# Altium schematic sheet USBC_B.SchDoc: DARKYDEN_USBC_B
size Letter; ApprovedBy: APPROUVÉ PAR; Author: Harold Malbrouck; Organization: Cegep Limoilou; Address1: 1300, 8e Avenue; Address2: Québec, QC; Address3: Canada; Address4: G1J 5L5; Revision: Rev.E; SheetNumber: 2; SheetTotal: 22
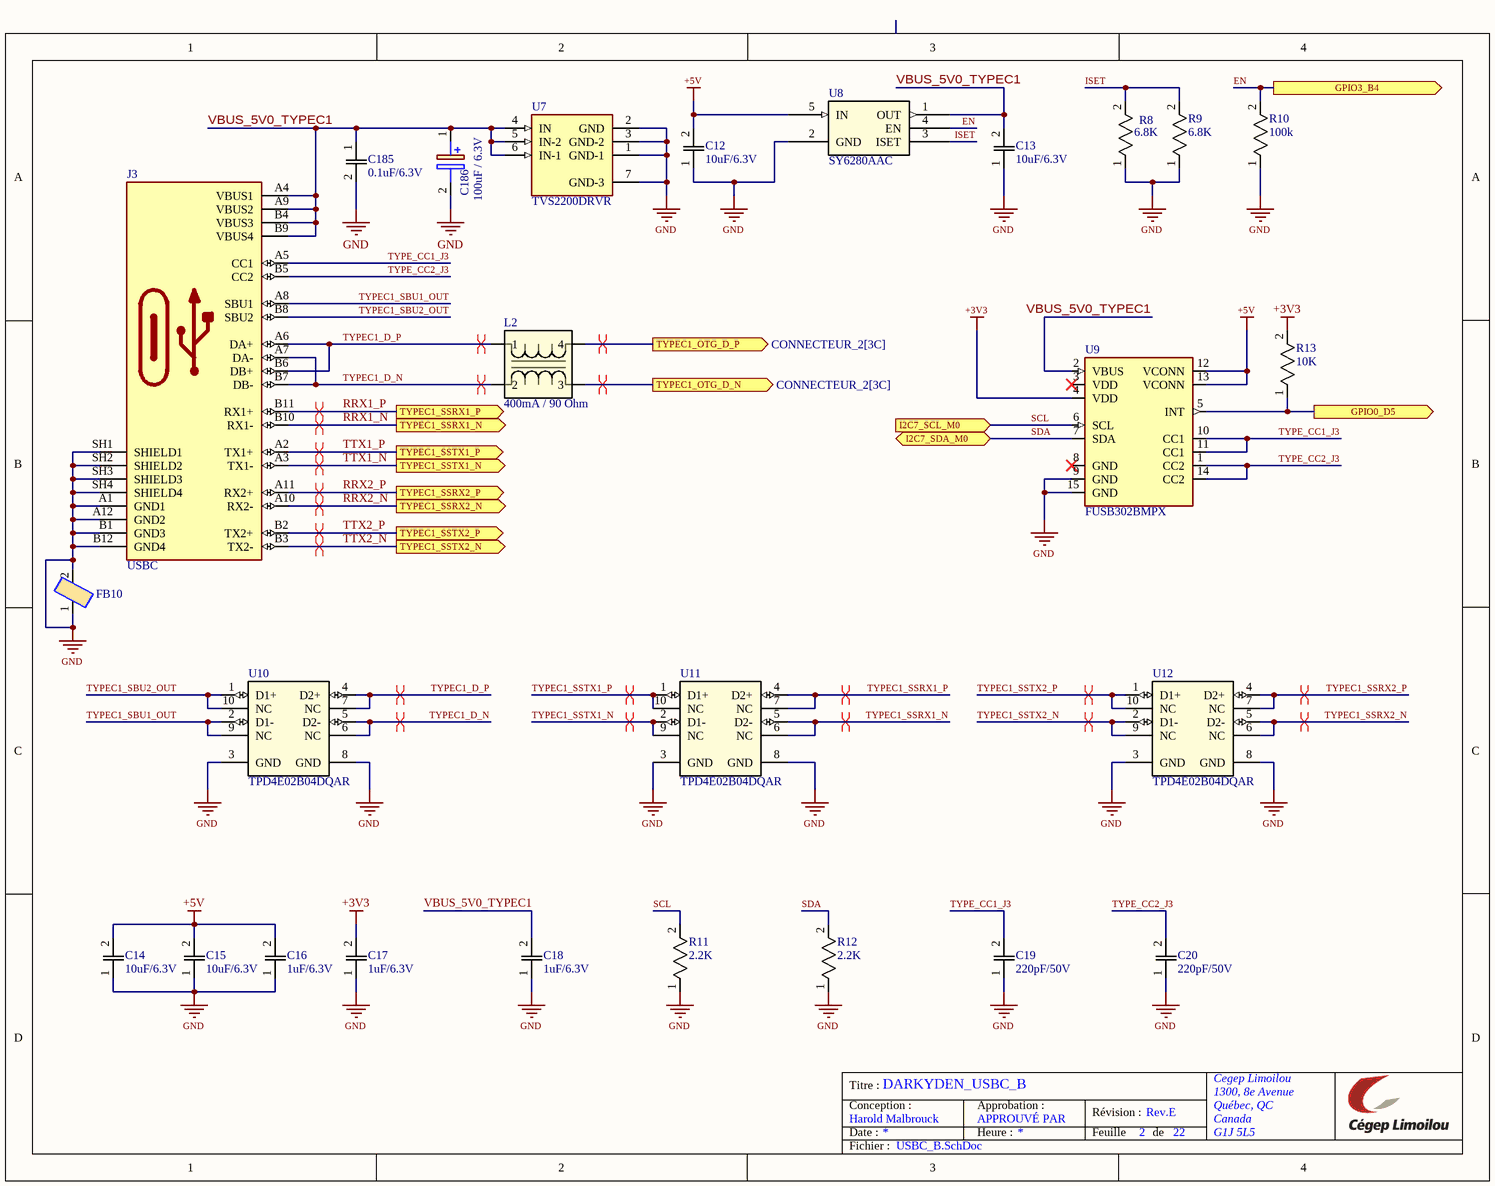
[diagram p0: USBC_B.SchDoc]

## Parts
C12  10uF/6.3V  [C0805]
C13  10uF/6.3V  [C0805]
C14  10uF/6.3V  [C0805]
C15  10uF/6.3V  [C0805]
C16  1uF/6.3V  [C0805]
C17  1uF/6.3V  [C0805]
C18  1uF/6.3V  [C0805]
C19  220pF/50V  [CAPC220145_88N_KEM]
C20  220pF/50V  [CAPC220145_88N_KEM]
C185  0.1uF/6.3V  [C0805]
C186  100uF / 6.3V  [EEE0GA101SR]
FB10  220R / 100MHz  [BLM18SP221SN1B]  (value not drawn)
J3  USBC  [MOLEX_2012670005]
L2  400mA / 90 Ohm  [ACM20129002PT002]
R8  6.8K  [ERJ3EKF1000V]
R9  6.8K  [ERJ3EKF1000V]
R10  100k  [ERJ3EKF1000V]
R11  2.2K  [ERJ3EKF1000V]
R12  2.2K  [ERJ3EKF1000V]
R13  10K  [ERJ3EKF1000V]
U7  TVS2200DRVR  [SON65P200X200X80-7N]
U8  SY6280AAC  [SOT95P285X140-5N]
U9  FUSB302BMPX  [QFN50P250X250X80-15N]
U10  TPD4E02B04DQAR  [DQA0010A]
U11  TPD4E02B04DQAR  [DQA0010A]
U12  TPD4E02B04DQAR  [DQA0010A]

## Ports
GPIO0_D5 (out, see CONNECTEUR_3[3C]), GPIO3_B4 (out, see CONNECTEUR_4[3C]), I2C7_SCL_M0 (in, see CONNECTEUR_2[1A]), I2C7_SDA_M0 (bidir, see CONNECTEUR_2[1A]), TYPEC1_OTG_D_N (out, see CONNECTEUR_2[3C]), TYPEC1_OTG_D_P (out, see CONNECTEUR_2[3C]), TYPEC1_SSRX1_N (out, see CONNECTEUR_2[1C]), TYPEC1_SSRX1_P (out, see CONNECTEUR_2[1C]), TYPEC1_SSRX2_N (out, see CONNECTEUR_2[1C]), TYPEC1_SSRX2_P (out, see CONNECTEUR_2[1C]), TYPEC1_SSTX1_N (out, see CONNECTEUR_2[1C]), TYPEC1_SSTX1_P (out, see CONNECTEUR_2[1C]), TYPEC1_SSTX2_N (out, see CONNECTEUR_2[1C]), TYPEC1_SSTX2_P (out, see CONNECTEUR_2[1C])

## Nets
+3V3: C17.2 R13.2 U9.4(VDD)
+5V: C12.2 C14.2 C15.2 C16.2 U8.5(IN) U9.12(VCONN) U9.13(VCONN)
GND: C12.1 C13.1 C14.1 C15.1 C16.1 C17.1 C18.1 C19.1 C20.1 C185.2 C186.2(-) FB10.1 FB10.2 J3.A1(GND1) J3.A12(GND2) J3.B1(GND3) J3.B12(GND4) J3.SH1(SHIELD1) J3.SH2(SHIELD2) J3.SH3(SHIELD3) J3.SH4(SHIELD4) R8.1 R9.1 R10.1 R11.1 R12.1 U7.1(GND-1) U7.2(GND) U7.3(GND-2) U7.7(GND-3) U8.2(GND) U9.9(GND) U9.15(GND) U10.3(GND) U10.8(GND) U11.3(GND) U11.8(GND) U12.3(GND) U12.8(GND)
EN: R10.2 U8.4(EN) ; port GPIO3_B4
GPIO0_D5: R13.1 U9.5(INT) ; port GPIO0_D5
ISET: R8.2 R9.2 U8.3(ISET)
RRX1_N: J3.B10(RX1-) ; port TYPEC1_SSRX1_N
RRX1_P: J3.B11(RX1+) ; port TYPEC1_SSRX1_P
RRX2_N: J3.A10(RX2-) ; port TYPEC1_SSRX2_N
RRX2_P: J3.A11(RX2+) ; port TYPEC1_SSRX2_P
SCL: R11.2 U9.6(SCL) ; port I2C7_SCL_M0
SDA: R12.2 U9.7(SDA) ; port I2C7_SDA_M0
TTX1_N: J3.A3(TX1-) ; port TYPEC1_SSTX1_N
TTX1_P: J3.A2(TX1+) ; port TYPEC1_SSTX1_P
TTX2_N: J3.B3(TX2-) ; port TYPEC1_SSTX2_N
TTX2_P: J3.B2(TX2+) ; port TYPEC1_SSTX2_P
TYPE_CC1_J3: C19.2 J3.A5(CC1) U9.10(CC1) U9.11(CC1)
TYPE_CC2_J3: C20.2 J3.B5(CC2) U9.1(CC2) U9.14(CC2)
TYPEC1_D_N: J3.A7(DA-) J3.B7(DB-) L2.2 U10.5(D2-) U10.6(NC)
TYPEC1_D_P: J3.A6(DA+) J3.B6(DB+) L2.1 U10.4(D2+) U10.7(NC)
TYPEC1_OTG_D_N: L2.3 ; port TYPEC1_OTG_D_N
TYPEC1_OTG_D_P: L2.4 ; port TYPEC1_OTG_D_P
TYPEC1_SBU1_OUT: J3.A8(SBU1) U10.2(D1-) U10.9(NC)
TYPEC1_SBU2_OUT: J3.B8(SBU2) U10.1(D1+) U10.10(NC)
TYPEC1_SSRX1_N: U11.5(D2-) U11.6(NC)
TYPEC1_SSRX1_P: U11.4(D2+) U11.7(NC)
TYPEC1_SSRX2_N: U12.5(D2-) U12.6(NC)
TYPEC1_SSRX2_P: U12.4(D2+) U12.7(NC)
TYPEC1_SSTX1_N: U11.2(D1-) U11.9(NC)
TYPEC1_SSTX1_P: U11.1(D1+) U11.10(NC)
TYPEC1_SSTX2_N: U12.2(D1-) U12.9(NC)
TYPEC1_SSTX2_P: U12.1(D1+) U12.10(NC)
VBUS_5V0_TYPEC1: C13.2 C18.2 C185.1 C186.1(+) J3.A4(VBUS1) J3.A9(VBUS2) J3.B4(VBUS3) J3.B9(VBUS4) U7.4(IN) U7.5(IN-2) U7.6(IN-1) U8.1(OUT) U9.2(VBUS)

Not connected (* = marked no-connect by the designer): U9 3(VDD)* 8(GND)*

## Layout directives
differential pair: RRX1_N, RRX1_P, RRX2_N, RRX2_P, TTX1_N, TTX1_P, TTX2_N, TTX2_P, TYPEC1_D_N, TYPEC1_D_P, TYPEC1_OTG_D_N, TYPEC1_OTG_D_P, TYPEC1_SSRX1_N, TYPEC1_SSRX1_P, TYPEC1_SSRX2_N, TYPEC1_SSRX2_P, TYPEC1_SSTX1_N, TYPEC1_SSTX1_P, TYPEC1_SSTX2_N, TYPEC1_SSTX2_P

## Notes on the sheet
- Titre :
- Conception :
- Date :
- Approbation :
- Heure :
- Révision :
- Feuille
- de
- Fichier :

## Library data of the parts
C12-C15 = C0805C106K9RACTU: 10uF/6.3V SMD Comm X7R 0805 (2012Metric) Ceramic Capacitor 0.079Lx0.049W 2.00mmx1.25mm X7R ±10% 10muF; Manufacturer_Name: KEMET; Material: 4241ConductorMaterial; Value: 10uF; Voltage Rating: 6.3V; Dissipation Factor: 7.5%; Datasheet Link: https://content.kemet.com/datasheets/KEM_C1002_X7R_SMD.pdf; Height: 1.1mm; Manufacturer_Part_Number: C0805C106K9RACTU; Mouser Part Number: 80-C0805C106K9R; Mouser Price/Stock: https://www.mouser.co.uk/ProductDetail/KEMET/C0805C106K9RACTU?qs=iP0bYSAMAFo3iKcrfaqAag%3D%3D; Arrow Part Number: C0805C106K9RACTU; Arrow Price/Stock: https://www.arrow.com/en/products/c0805c106k9ractu/kemet-corporation?region=nac; Supplier: Digikey; Supplier Part Number: 399-C0805C106K9RACTUCT-ND; Manufacturer: KEMET; Manufacturer Part Number: C0805C106K9RACTU; RoHS: Yes; Category: Ceramic Capacitors; Stock: 12575; Pricing: 1=0.34, 10=0.203, 100=0.1327, 1000=0.0974 (USD); Mounting Technology: Surface Mount; Case/Package: 0805; Case Code (Metric): 2012; Case Code (Imperial): 0805; Dielectric Material: Ceramic; Min Operating Temperature: -55°C; Max Operating Temperature: 125°C; Package Quantity: 1; Tolerance: 10%; Packaging: Tape and Reel; Voltage Rating (DC): 6.3V; Dielectric: X7R; Termination: SMD/SMT; Series: C; Length: 2mm; Width: 0.049inch; Thickness: 0.055inch; Depth: 1.25mm; Reach SVHC Compliant: No; RoHS Compliant: Yes; ComponentLink1URL: http://www.farnell.com/datasheets/2745931.pdf?src-supplier=Farnell; ComponentLink1Description: http://www.farnell.com/datasheets/2745931.pdf?src-supplier=Farnell; ComponentLink2URL: http://www.mouser.com/ds/2/212/KEM_C1002_X7R_SMD-1102033.pdf?src-supplier=Mouser; ComponentLink2Description: http://www.mouser.com/ds/2/212/KEM_C1002_X7R_SMD-1102033.pdf?src-supplier=Mouser; ComponentLink3URL: http://datasheet.octopart.com/C0805C106K9RACTU-KEMET-datasheet-157246124.pdf?src-supplier=Avnet; ComponentLink3Description: http://datasheet.octopart.com/C0805C106K9RACTU-KEMET-datasheet-157246124.pdf?src-supplier=Avnet; ComponentLink4URL: http://datasheet.octopart.com/C0805C106K9RACTU-KEMET-datasheet-157246124.pdf?src-supplier=Verical; ComponentLink4Description: http://datasheet.octopart.com/C0805C106K9RACTU-KEMET-datasheet-157246124.pdf?src-supplier=Verical; ComponentLink5URL: http://datasheet.octopart.com/C0805C106K9RACTU-KEMET-datasheet-157246124.pdf?src-supplier=Onlinecomponents.com; ComponentLink5Description: http://datasheet.octopart.com/C0805C106K9RACTU-KEMET-datasheet-157246124.pdf?src-supplier=Onlinecomponents.com; ComponentLink6URL: http://components.arrow.com/part/dataview/53801129S170069N7429?src-supplier=Arrow+Electronics; ComponentLink6Description: http://components.arrow.com/part/dataview/53801129S170069N7429?src-supplier=Arrow+Electronics; ComponentLink7URL: http://www.farnell.com/datasheets/1828800.pdf?src-supplier=Newark; ComponentLink7Description: http://www.farnell.com/datasheets/1828800.pdf?src-supplier=Newark; ComponentLink8URL: http://datasheet.octopart.com/C0805C106K9RACTU-KEMET-datasheet-157246124.pdf?src-supplier=Digikey; ComponentLink8Description: http://datasheet.octopart.com/C0805C106K9RACTU-KEMET-datasheet-157246124.pdf?src-supplier=Digikey; ComponentLink9URL: https://api.kemet.com/component-edge/download/datasheet/C0805C106K9RACTU.pdf?src-supplier=Digikey; ComponentLink9Description: https://api.kemet.com/component-edge/download/datasheet/C0805C106K9RACTU.pdf?src-supplier=Digikey; ComponentLink10URL: http://www.farnell.com/datasheets/2745931.pdf?src-supplier=Element14; ComponentLink10Description: http://www.farnell.com/datasheets/2745931.pdf?src-supplier=Element14; ComponentLink11URL: https://datasheet.octopart.com/C0805C106K9RACTU-Kemet-datasheet-66076756.pdf?src-supplier=Element14; ComponentLink11Description: https://datasheet.octopart.com/C0805C106K9RACTU-Kemet-datasheet-66076756.pdf?src-supplier=Element14; ComponentLink12URL: http://datasheet.octopart.com/C0805C106K9RACTU-KEMET-datasheet-157246124.pdf?src-supplier=Rs; ComponentLink12Description: http://datasheet.octopart.com/C0805C106K9RACTU-KEMET-datasheet-157246124.pdf?src-supplier=Rs; ComponentLink13URL: http://www.farnell.com/datasheets/1791936.pdf?src-supplier=Newark; ComponentLink13Description: http://www.farnell.com/datasheets/1791936.pdf?src-supplier=Newark; ComponentLink14URL: http://datasheet.octopart.com/C0805C106K9RACTU-KEMET-datasheet-157246124.pdf?src-supplier=Electro+Sonic; ComponentLink14Description: http://datasheet.octopart.com/C0805C106K9RACTU-KEMET-datasheet-157246124.pdf?src-supplier=Electro+Sonic; ComponentLink15URL: https://datasheet.octopart.com/C0805C106K9RACTU-KEMET-datasheet-157246124.pdf?src-supplier=TME; ComponentLink15Description: https://datasheet.octopart.com/C0805C106K9RACTU-KEMET-datasheet-157246124.pdf?src-supplier=TME; ComponentLink16URL: http://datasheet.octopart.com/C0805C106K9RACTU-KEMET-datasheet-157246124.pdf?src-supplier=NAC+Semi; ComponentLink16Description: http://datasheet.octopart.com/C0805C106K9RACTU-KEMET-datasheet-157246124.pdf?src-supplier=NAC+Semi
C16-C18 = C0805C105K9RACTU: 1 uF, 6.3 V, ± 10%, X7R, 0805 [2012 Metric] Multilayer Ceramic Capacitor,; Manufacturer_Name: KEMET; Value: 1uF; Voltage Rating: 6.3V; Datasheet Link: https://content.kemet.com/datasheets/KEM_C1002_X7R_SMD.pdf; Height: 1.1mm; Manufacturer_Part_Number: C0805C105K9RACTU; Mouser Part Number: 80-C0805C105K9R; Mouser Price/Stock: https://www.mouser.co.uk/ProductDetail/KEMET/C0805C105K9RACTU?qs=Nnkldhwoc36daYb4WU%2Fecw%3D%3D; Arrow Part Number: C0805C105K9RACTU; Arrow Price/Stock: https://www.arrow.com/en/products/c0805c105k9ractu/kemet-corporation?utm_currency=USD&region=nac; Supplier: Digikey; Supplier Part Number: 399-13161-1-ND; Manufacturer: KEMET; Manufacturer Part Number: C0805C105K9RACTU; RoHS: Yes; Category: Ceramic Capacitors; Stock: 8847; Pricing: 1=0.49, 10=0.397, 100=0.3017, 1000=0.24335, 2500=0.22102, 5000=0.20619, 7500=0.16784, 12500=0.12939, 17500=0.02492, 25000=0.02414, 62500=0.02244, 125000=0.02142, 250000=0.02059 (USD); Mounting Technology: Surface Mount; Case/Package: 0805; Case Code (Metric): 2012; Case Code (Imperial): 0805; Dielectric Material: Ceramic; Min Operating Temperature: -55°C; Max Operating Temperature: 125°C; Packaging: Tape and Reel; Tolerance: 10%; Package Quantity: 4000; Voltage Rating (DC): 6.3V; Dielectric: X7R; Termination: SMD/SMT; Series: C0805C; Construction: Flat; Length: 2mm; Width: 1.2mm; Thickness: 0.039inch; Lead Pitch: 0.75mm; Depth: 1.25mm; Radiation Hardening: No; RoHS Compliant: Yes; ComponentLink1URL: https://datasheet.ciiva.com/5416/kem-c1002-x7r-smd-5416463.pdf?src-supplier=Mouser; ComponentLink1Description: https://datasheet.ciiva.com/5416/kem-c1002-x7r-smd-5416463.pdf?src-supplier=Mouser
C19 C20 = C0805C221M5RACTU: Cap Ceramic 220pF 50V X7R 20% Pad SMD 0805 125C T/R; Mfr_Name: Kemet; Supplier: Digikey; Supplier Part Number: 399-C0805C221M5RACTUCT-ND; Manufacturer: KEMET; Manufacturer Part Number: C0805C221M5RACTU; RoHS: Yes; Category: Ceramic Capacitors; Stock: 68781; Pricing: 1=0.1, 10=0.086, 100=0.0162 (USD); Mounting Technology: Surface Mount; Case/Package: 0805; Case Code (Metric): 2012; Case Code (Imperial): 0805; Dielectric Material: Ceramic; Contact Plating: Tin,Matte; Min Operating Temperature: -55°C; Max Operating Temperature: 125°C; Package Quantity: 1; Value: 220pF; Voltage Rating: 50V; Tolerance: 20%; Packaging: Tape and Reel; Voltage Rating (DC): 50V; Dielectric: X7R; Termination: SMD/SMT; Series: C; Length: 2mm; Width: 0.049inch; Height: 0.78mm; Thickness: 0.035inch; Lead Pitch: 0.75mm; Depth: 1.25mm; ComponentLink1URL: http://www.farnell.com/datasheets/2746355.pdf?src-supplier=Farnell; ComponentLink1Description: http://www.farnell.com/datasheets/2746355.pdf?src-supplier=Farnell; ComponentLink2URL: http://www.mouser.com/ds/2/212/KEM_C1002_X7R_SMD-1102033.pdf?src-supplier=Mouser; ComponentLink2Description: http://www.mouser.com/ds/2/212/KEM_C1002_X7R_SMD-1102033.pdf?src-supplier=Mouser; ComponentLink3URL: http://components.arrow.com/part/dataview/2091709S5746747N7429?src-supplier=Arrow+Electronics; ComponentLink3Description: http://components.arrow.com/part/dataview/2091709S5746747N7429?src-supplier=Arrow+Electronics; ComponentLink4URL: https://api.kemet.com/component-edge/download/datasheet/C0805C221M5RACTU.pdf?src-supplier=Digikey; ComponentLink4Description: https://api.kemet.com/component-edge/download/datasheet/C0805C221M5RACTU.pdf?src-supplier=Digikey; ComponentLink5URL: https://datasheet.octopart.com/C0805C221M5RACTU-KEMET-datasheet-149524118.pdf?src-supplier=Farnell; ComponentLink5Description: https://datasheet.octopart.com/C0805C221M5RACTU-KEMET-datasheet-149524118.pdf?src-supplier=Farnell; ComponentLink6URL: http://capacitoredge.kemet.com/capedge2/DataSheet?pn=C0805C221M5RACTU&src-supplier=Avnet; ComponentLink6Description: http://capacitoredge.kemet.com/capedge2/DataSheet?pn=C0805C221M5RACTU&src-supplier=Avnet; ComponentLink7URL: https://datasheet.octopart.com/C0805C221M5RACTU-Kemet-datasheet-62307647.pdf?src-supplier=Element14; ComponentLink7Description: https://datasheet.octopart.com/C0805C221M5RACTU-Kemet-datasheet-62307647.pdf?src-supplier=Element14; ComponentLink8URL: http://www.farnell.com/datasheets/2746355.pdf?src-supplier=Newark; ComponentLink8Description: http://www.farnell.com/datasheets/2746355.pdf?src-supplier=Newark; ComponentLink9URL: https://datasheet.octopart.com/C0805C221M5RACTU-KEMET-datasheet-137045082.pdf?src-supplier=TME; ComponentLink9Description: https://datasheet.octopart.com/C0805C221M5RACTU-KEMET-datasheet-137045082.pdf?src-supplier=TME
C185 = C0805C104K9RACTU: 0.1uF 6.3V X7R 10% Pad SMD 0805 125C T/R; Manufacturer_Name: KEMET; Dielectric Material: Ceramic; Material: 4241ConductorMaterial; Value: 100nF; Datasheet Link: https://content.kemet.com/datasheets/KEM_C1002_X7R_SMD.pdf; Height: 1.1mm; Manufacturer_Part_Number: C0805C104K9RACTU; Mouser Part Number: 80-C0805C104K9R; Mouser Price/Stock: https://www.mouser.co.uk/ProductDetail/KEMET/C0805C104K9RACTU?qs=jbCUrP3sAgRYLjBU7s5h8Q%3D%3D; Arrow Part Number: C0805C104K9RACTU; Arrow Price/Stock: https://www.arrow.com/en/products/c0805c104k9ractu/kemet-corporation; Supplier: Digikey; Supplier Part Number: 399-C0805C104K9RACTUCT-ND; Manufacturer: KEMET; Manufacturer Part Number: C0805C104K9RACTU; RoHS: Yes; Category: Ceramic Capacitors; Stock: 68008; Pricing: 1=0.21, 10=0.214, 100=0.1506, 1000=0.11154 (USD); Mounting Technology: Surface Mount; Case/Package: 0805; Case Code (Metric): 2012; Case Code (Imperial): 0805; Min Operating Temperature: -55°C; Max Operating Temperature: 125°C; Package Quantity: 4000; Voltage Rating: 6.3V; Tolerance: 10%; Packaging: Tape and Reel; Voltage Rating (DC): 6.3V; Dielectric: X7R; Termination: SMD/SMT; Series: SMD Comm X7R; Construction: Flat; Length: 2mm; Width: 1.2mm; Thickness: 0.039inch; Depth: 1.25mm; Radiation Hardening: No; RoHS Compliant: Yes; ComponentLink1URL: http://www.farnell.com/datasheets/2746329.pdf?src-supplier=Farnell; ComponentLink1Description: http://www.farnell.com/datasheets/2746329.pdf?src-supplier=Farnell; ComponentLink2URL: http://www.mouser.com/ds/2/212/KEM_C1002_X7R_SMD-1102033.pdf?src-supplier=Mouser; ComponentLink2Description: http://www.mouser.com/ds/2/212/KEM_C1002_X7R_SMD-1102033.pdf?src-supplier=Mouser; ComponentLink3URL: http://datasheet.octopart.com/C0805C104K9RACTU-KEMET-datasheet-157246124.pdf?src-supplier=Avnet; ComponentLink3Description: http://datasheet.octopart.com/C0805C104K9RACTU-KEMET-datasheet-157246124.pdf?src-supplier=Avnet; ComponentLink4URL: http://datasheet.octopart.com/C0805C104K9RACTU-KEMET-datasheet-157246124.pdf?src-supplier=Onlinecomponents.com; ComponentLink4Description: http://datasheet.octopart.com/C0805C104K9RACTU-KEMET-datasheet-157246124.pdf?src-supplier=Onlinecomponents.com; ComponentLink5URL: http://capacitoredge.kemet.com/capedge2/DataSheet?pn=C0805C104K9RACTU&src-supplier=Avnet; ComponentLink5Description: http://capacitoredge.kemet.com/capedge2/DataSheet?pn=C0805C104K9RACTU&src-supplier=Avnet; ComponentLink6URL: http://www.farnell.com/datasheets/2746329.pdf?src-supplier=Newark; ComponentLink6Description: http://www.farnell.com/datasheets/2746329.pdf?src-supplier=Newark; ComponentLink7URL: http://datasheet.octopart.com/C0805C104K9RACTU-KEMET-datasheet-157246124.pdf?src-supplier=Digikey; ComponentLink7Description: http://datasheet.octopart.com/C0805C104K9RACTU-KEMET-datasheet-157246124.pdf?src-supplier=Digikey; ComponentLink8URL: https://api.kemet.com/component-edge/download/datasheet/C0805C104K9RACTU.pdf?src-supplier=Digikey; ComponentLink8Description: https://api.kemet.com/component-edge/download/datasheet/C0805C104K9RACTU.pdf?src-supplier=Digikey; ComponentLink9URL: https://datasheet.octopart.com/C0805C104K9RACTU.-KEMET-datasheet-179056791.pdf?src-supplier=Element14; ComponentLink9Description: https://datasheet.octopart.com/C0805C104K9RACTU.-KEMET-datasheet-179056791.pdf?src-supplier=Element14; ComponentLink10URL: https://datasheet.octopart.com/C0805C104K9RACTU-KEMET-datasheet-137357759.pdf?src-supplier=Farnell; ComponentLink10Description: https://datasheet.octopart.com/C0805C104K9RACTU-KEMET-datasheet-137357759.pdf?src-supplier=Farnell; ComponentLink11URL: http://www.farnell.com/datasheets/2746329.pdf?src-supplier=Element14; ComponentLink11Description: http://www.farnell.com/datasheets/2746329.pdf?src-supplier=Element14; ComponentLink12URL: https://datasheet.octopart.com/C0805C104K9RACTU-KEMET-datasheet-157246124.pdf?src-supplier=TME; ComponentLink12Description: https://datasheet.octopart.com/C0805C104K9RACTU-KEMET-datasheet-157246124.pdf?src-supplier=TME; ComponentLink13URL: http://datasheet.octopart.com/C0805C104K9RACTU-KEMET-datasheet-157246124.pdf?src-supplier=TTI; ComponentLink13Description: http://datasheet.octopart.com/C0805C104K9RACTU-KEMET-datasheet-157246124.pdf?src-supplier=TTI; ComponentLink14URL: http://datasheet.octopart.com/C0805C104K9RACTU-KEMET-datasheet-157246124.pdf?src-supplier=Electro+Sonic; ComponentLink14Description: http://datasheet.octopart.com/C0805C104K9RACTU-KEMET-datasheet-157246124.pdf?src-supplier=Electro+Sonic
C186 = EEE-FPJ101UAR: 100uF 6.3V 20% Cap Aluminum Lytic  SMD 0.36 Ohm 240mA 2000h 105C Automotive T/R; Manufacturer_Name: Panasonic; Material: Aluminium; ESR (Equivalent Series Resistance): 360mR; Life (Hours): 2000Hour; Leakage Current: 6.3uA; Datasheet Link: http://industrial.panasonic.com/cdbs/www-data/pdf/RDE0000/ABA0000C1184.pdf; Height: 6.5mm; Manufacturer_Part_Number: EEE-FPJ101UAR; Mouser Part Number: 667-EEE-FPJ101UAR; Mouser Price/Stock: https://www.mouser.co.uk/ProductDetail/Panasonic/EEE-FPJ101UAR?qs=d1CqaRUMZD%252BxJy4M83vA9g%3D%3D; Arrow Part Number: EEE-FPJ101UAR; Arrow Price/Stock: https://www.arrow.com/en/products/eee-fpj101uar/panasonic?utm_currency=USD&region=europe; Supplier: Digikey; Supplier Part Number: PCE4514CT-ND; Manufacturer: Panasonic; Manufacturer Part Number: EEE-FPJ101UAR; RoHS: Yes; Category: Aluminum Electrolytic Capacitors; Stock: 28785; Pricing: 1=0.56, 10=0.35, 50=0.2602, 100=0.2317, 500=0.18256 (USD); Mounting Technology: Surface Mount,PCB; Case/Package: Radial; Dielectric Material: Aluminium; Min Operating Temperature: -55°C; Max Operating Temperature: 105°C; Value: 100uF; Packaging: Tape and Reel; Voltage Rating (DC): 6.3V; Package Quantity: 1; Termination: SMD/SMT; Series: FP; Ripple Current: 240mA; Tolerance: 20%; Voltage Rating: 6.3V; Ripple Current (AC): 240mA; Voltage: 6.3V; Construction: Cylindrical; Diameter: 5mm; Length: 6.1mm; Lead Pitch: 1.5mm; Height - Seated (Max): 0.228inch; Radiation Hardening: No; Lead Free: Lead Free; RoHS Compliant: Yes; Reach SVHC Compliant: Unknown; ComponentLink1URL: https://datasheet.ciiva.com/11777/0900766b80df09a1-11777260.pdf?src-supplier=Rs; ComponentLink1Description: https://datasheet.ciiva.com/11777/0900766b80df09a1-11777260.pdf?src-supplier=Rs; ComponentLink2URL: https://datasheet.ciiva.com/25614/0900766b80df09a1-25614042.pdf?src-supplier=Rs; ComponentLink2Description: https://datasheet.ciiva.com/25614/0900766b80df09a1-25614042.pdf?src-supplier=Rs; ComponentLink3URL: https://datasheet.ciiva.com/2985/aba0000ce114-2985560.pdf?src-supplier=Avnet; ComponentLink3Description: https://datasheet.ciiva.com/2985/aba0000ce114-2985560.pdf?src-supplier=Avnet; ComponentLink4URL: https://datasheet.ciiva.com/30259/aba0000ce114-30259452.pdf?src-supplier=Onlinecomponents.com; ComponentLink4Description: https://datasheet.ciiva.com/30259/aba0000ce114-30259452.pdf?src-supplier=Onlinecomponents.com; ComponentLink5URL: https://datasheet.ciiva.com/14597/70068195-14597061.pdf?src-supplier=Allied+Electronics; ComponentLink5Description: https://datasheet.ciiva.com/14597/70068195-14597061.pdf?src-supplier=Allied+Electronics; ComponentLink6URL: https://datasheet.ciiva.com/14606/70068195-14606383.pdf?src-supplier=Allied+Electronics; ComponentLink6Description: https://datasheet.ciiva.com/14606/70068195-14606383.pdf?src-supplier=Allied+Electronics; ComponentLink7URL: https://datasheet.ciiva.com/48523/fp-eng-tds-48523719.pdf?src-supplier=Distrelec; ComponentLink7Description: https://datasheet.ciiva.com/48523/fp-eng-tds-48523719.pdf?src-supplier=Distrelec; ComponentLink8URL: https://datasheet.ciiva.com/46391/370232-46391160.pdf?src-supplier=Element14; ComponentLink8Description: https://datasheet.ciiva.com/46391/370232-46391160.pdf?src-supplier=Element14; ComponentLink9URL: https://datasheet.ciiva.com/46398/370232-46398005.pdf?src-supplier=Element14; ComponentLink9Description: https://datasheet.ciiva.com/46398/370232-46398005.pdf?src-supplier=Element14
FB10 = BLM18EG221SN1D: Ferrite Beads Multi-Layer 220Ohm 25% 100MHz 2A 50mOhm DCR 0603 Paper T/R; Manufacturer_Name: Murata Electronics; Manufacturer: Murata; Material: Steel,Ferrite; Value: 50mR; Number of Lines: 1; Number of Circuits: 1NUMBER; Datasheet Link: http://www.murata.com/~/media/webrenewal/support/library/catalog/products/emc/emifil/c31e.ashx?la=en-gb; Height: 0.95mm; Manufacturer_Part_Number: BLM18EG221SN1D; Mouser Part Number: 81-BLM18EG221SN1D; Mouser Price/Stock: https://www.mouser.co.uk/ProductDetail/Murata-Electronics/BLM18EG221SN1D?qs=uSeJpk%2F8In2DDeSj2a4KGA%3D%3D; Arrow Part Number: BLM18EG221SN1D; Arrow Price/Stock: https://www.arrow.com/en/products/blm18eg221sn1d/murata-manufacturing?utm_currency=USD&region=nac; Supplier: Digikey; Supplier Part Number: 490-3992-1-ND; Manufacturer Part Number: BLM18EG221SN1D; RoHS: Yes; Category: Ferrite Beads and Chips; Stock: 133283; Pricing: 1=0.24, 10=0.167, 25=0.1444, 50=0.1292, 100=0.1154, 250=0.09864, 500=0.08708, 1000=0.07636 (USD); Case/Package: 0603; Pins: 2; Core Material: Ferrite; Case Code (Metric): 1608; Case Code (Imperial): 0603; Min Operating Temperature: -55°C; Max Operating Temperature: 125°C; Tolerance: 25%; Impedance: 220R; Package Quantity: 1; Packaging: Tape and Reel; Current Rating: 2A; Max Current Rating: 2A; DC Resistance (DCR): 50mR; Max DC Current: 2A; Termination: SMD/SMT; Test Frequency: 100MHz; DC Current: 2A; Series: BLM18E; DC Resistance-Max: 50mR; RMS Current (Irms): 2A; ESR: 50mR; Frequency: 100MHz; Length: 1.6mm; Width: 0.8mm; Depth: 0.8mm; Radiation Hardening: No; Reach SVHC Compliant: No; Military Standard: Not; Lead Free: Lead Free; RoHS Compliant: Yes; ComponentLink1URL: https://datasheet.ciiva.com/11799/0900766b811b5866-11799010.pdf?src-supplier=Rs; ComponentLink1Description: https://datasheet.ciiva.com/11799/0900766b811b5866-11799010.pdf?src-supplier=Rs; ComponentLink2URL: https://datasheet.ciiva.com/41449/001171699-da-01-en-chip-drossel0603-220r-2000ma-1-6x0-8mm-41449376.pdf?src-supplier=Conrad; ComponentLink2Description: https://datasheet.ciiva.com/41449/001171699-da-01-en-chip-drossel0603-220r-2000ma-1-6x0-8mm-41449376.pdf?src-supplier=Conrad; ComponentLink3URL: https://datasheet.ciiva.com/41449/001172265-da-01-en-drossel-0603-220r-1-6x0-8mm-4000st-41449579.pdf?src-supplier=Conrad; ComponentLink3Description: https://datasheet.ciiva.com/41449/001172265-da-01-en-drossel-0603-220r-1-6x0-8mm-4000st-41449579.pdf?src-supplier=Conrad; ComponentLink4URL: https://datasheet.ciiva.com/1012/l0110s0101blm18e-1012872.pdf?src-supplier=Digikey; ComponentLink4Description: https://datasheet.ciiva.com/1012/l0110s0101blm18e-1012872.pdf?src-supplier=Digikey; ComponentLink5URL: https://datasheet.ciiva.com/1012/l0110s0101blm18e-1012873.pdf?src-supplier=Digikey; ComponentLink5Description: https://datasheet.ciiva.com/1012/l0110s0101blm18e-1012873.pdf?src-supplier=Digikey; ComponentLink6URL: https://datasheet.ciiva.com/1012/l0110s0101blm18e-1012874.pdf?src-supplier=Digikey; ComponentLink6Description: https://datasheet.ciiva.com/1012/l0110s0101blm18e-1012874.pdf?src-supplier=Digikey; ComponentLink7URL: https://datasheet.ciiva.com/14122/blm-series-eng-tds-14122908.pdf?src-supplier=Distrelec; ComponentLink7Description: https://datasheet.ciiva.com/14122/blm-series-eng-tds-14122908.pdf?src-supplier=Distrelec; ComponentLink8URL: https://datasheet.ciiva.com/1467/5169-1467157.pdf?src-supplier=Element14; ComponentLink8Description: https://datasheet.ciiva.com/1467/5169-1467157.pdf?src-supplier=Element14; ComponentLink9URL: https://datasheet.ciiva.com/1467/5169-1467158.pdf?src-supplier=Element14; ComponentLink9Description: https://datasheet.ciiva.com/1467/5169-1467158.pdf?src-supplier=Element14; ComponentLink10URL: https://datasheet.ciiva.com/8510/l0110s0101blm18e-8510140.pdf?src-supplier=Avnet; ComponentLink10Description: https://datasheet.ciiva.com/8510/l0110s0101blm18e-8510140.pdf?src-supplier=Avnet; ComponentLink11URL: https://datasheet.ciiva.com/16419/l0110s0101blm18e-16419148.pdf?src-supplier=Future+Electronics; ComponentLink11Description: https://datasheet.ciiva.com/16419/l0110s0101blm18e-16419148.pdf?src-supplier=Future+Electronics
J3 = USBC: USB-C (USB TYPE-C) USB 3.2 Gen 2 (USB 3.1 Gen 2, Superspeed + (USB 3.1)) Receptacle Connector 24 Position Surface Mount, Right Angle; Through Hole; MF: Molex; MP: 2012670005; SnapEDA_Link: https://www.snapeda.com/parts/2012670005/Molex/view-part/?ref=snap; Package: None; Value: *; Check_prices: https://www.snapeda.com/parts/2012670005/Molex/view-part/?ref=eda
L2 = ACM2012-900-2P-T002: Ferrite Beads Wirewound Common Mode Filter 90Ohm 100MHz 400mA 0805 T/R; Manufacturer_Name: TDK; Impedance: 90R; Voltage Rating: 50V; Number of Lines: 2; DC Resistance (DCR): 190mR; Shielding: Shielded; Datasheet Link: https://product.tdk.com/system/files/dam/doc/product/emc/emc/cmf_cmc/catalog/cmf_commercial_signal_acm2012_en.pdf; Height: 1.3mm; Manufacturer_Part_Number: ACM2012-900-2P-T002; Mouser Part Number: 810-ACM20129002PT002; Mouser Price/Stock: https://www.mouser.co.uk/ProductDetail/TDK/ACM2012-900-2P-T002?qs=vhEaPADELPHXWaCJFQVZjQ%3D%3D; Arrow Part Number: ACM2012-900-2P-T002; Arrow Price/Stock: https://www.arrow.com/en/products/acm2012-900-2p-t002/tdk?utm_currency=USD&region=europe; Supplier: Digikey; Supplier Part Number: 445-2207-1-ND; Manufacturer: TDK; Manufacturer Part Number: ACM2012-900-2P-T002; RoHS: Yes; Category: Common Mode Chokes; Stock: 26254; Pricing: 1=0.34, 10=0.277, 25=0.2564, 50=0.2416, 100=0.2278, 250=0.21076, 500=0.1987, 1000=0.18735 (USD); Mounting Technology: Surface Mount; Case/Package: 0805; Pins: 4; Case Code (Metric): 2012; Case Code (Imperial): 0805; Core Material: Ferrite; Min Operating Temperature: -40°C; Max Operating Temperature: 85°C; Packaging: Tape and Reel; Package Quantity: 1; Voltage Rating (DC): 50V; Current Rating: 400mA; Max DC Current: 400mA; Termination: SMD/SMT; Test Frequency: 100MHz; Current: 400mA; DC Current: 400mA; Series: ACM; DC Resistance-Max: 190mR; Max Current Rating: 400mA; RMS Current (Irms): 400mA; ESR: 190mR; Coil Resistance: 190mR; Length: 2.2mm; Width: 0.047inch; Depth: 1.4mm; Radiation Hardening: No; Reach SVHC Compliant: No; Military Standard: Not; RoHS Compliant: Yes; Lead Free: 5697LeadFree; ComponentLink1URL: https://datasheet.ciiva.com/26946/getdatasheetpartid-664745-26946491.pdf?src-supplier=Verical; ComponentLink1Description: https://datasheet.ciiva.com/26946/getdatasheetpartid-664745-26946491.pdf?src-supplier=Verical; ComponentLink2URL: https://datasheet.ciiva.com/1127/1750020-1127257.pdf?src-supplier=Element14; ComponentLink2Description: https://datasheet.ciiva.com/1127/1750020-1127257.pdf?src-supplier=Element14; ComponentLink3URL: https://datasheet.ciiva.com/22726/1750020-22726278.pdf?src-supplier=Element14; ComponentLink3Description: https://datasheet.ciiva.com/22726/1750020-22726278.pdf?src-supplier=Element14; ComponentLink4URL: https://datasheet.ciiva.com/28428/1750020-28428616.pdf?src-supplier=Element14; ComponentLink4Description: https://datasheet.ciiva.com/28428/1750020-28428616.pdf?src-supplier=Element14; ComponentLink5URL: https://datasheet.ciiva.com/46450/1750020-46450939.pdf?src-supplier=Element14; ComponentLink5Description: https://datasheet.ciiva.com/46450/1750020-46450939.pdf?src-supplier=Element14; ComponentLink6URL: https://datasheet.ciiva.com/1007/e9712-acm-1007624.pdf?src-supplier=Digikey; ComponentLink6Description: https://datasheet.ciiva.com/1007/e9712-acm-1007624.pdf?src-supplier=Digikey; ComponentLink7URL: https://datasheet.ciiva.com/1007/e9712-acm-1007623.pdf?src-supplier=Digikey; ComponentLink7Description: https://datasheet.ciiva.com/1007/e9712-acm-1007623.pdf?src-supplier=Digikey; ComponentLink8URL: https://datasheet.ciiva.com/1007/e9712-acm-1007625.pdf?src-supplier=Digikey; ComponentLink8Description: https://datasheet.ciiva.com/1007/e9712-acm-1007625.pdf?src-supplier=Digikey; ComponentLink9URL: https://datasheet.ciiva.com/4941/tdk-e9712-acm-332263-4941941.pdf?src-supplier=Mouser; ComponentLink9Description: https://datasheet.ciiva.com/4941/tdk-e9712-acm-332263-4941941.pdf?src-supplier=Mouser; ComponentLink10URL: https://datasheet.ciiva.com/16416/e9712-acm-16416522.pdf?src-supplier=Future+Electronics; ComponentLink10Description: https://datasheet.ciiva.com/16416/e9712-acm-16416522.pdf?src-supplier=Future+Electronics; ComponentLink11URL: https://datasheet.ciiva.com/8498/e9712-acm-8498823.pdf?src-supplier=Avnet; ComponentLink11Description: https://datasheet.ciiva.com/8498/e9712-acm-8498823.pdf?src-supplier=Avnet; ComponentLink12URL: https://datasheet.ciiva.com/16382/e9712-acm-16382582.pdf?src-supplier=Future+Electronics; ComponentLink12Description: https://datasheet.ciiva.com/16382/e9712-acm-16382582.pdf?src-supplier=Future+Electronics
R8 R9 = ERJ-3GEYJ682V: 6.8 kOhm, ± 5%, 100 mW, 0603 [1608 Metric], Thick Film, General Purpose; Manufacturer_Name: Panasonic; Voltage Rating: 75V; Value: 6.8kR; Power Rating: 100mW; Temperature Coefficient: 200ppm/°C; Voltage Rating (DC): 50V; Datasheet Link: http://docs-europe.electrocomponents.com/webdocs/13ba/0900766b813ba21b.pdf; Height: 0.55mm; Manufacturer_Part_Number: ERJ-3GEYJ682V; Arrow Part Number: ERJ-3GEYJ682V; Arrow Price/Stock: https://www.arrow.com/en/products/erj-3geyj682v/panasonic?region=nac; Supplier: Digikey; Supplier Part Number: P6.8KGCT-ND; Manufacturer: Panasonic; Manufacturer Part Number: ERJ-3GEYJ682V; RoHS: Yes; Category: Chip SMD Resistors; Stock: 78088; Pricing: 1=0.1, 10=0.033, 50=0.02, 100=0.0165, 500=0.01096, 1000=0.00939 (USD); Mounting Technology: Surface Mount; Case/Package: 0603; Case Code (Imperial): 0603; Case Code (Metric): 1608; Contact Plating: Tin; Min Operating Temperature: -55°C; Max Operating Temperature: 155°C; Tolerance: 5%; Packaging: Tape and Reel; Package Quantity: 1; Resistor Type: Thick Film; Termination: SMD/SMT; Number of Terminations: 2; Max Power Dissipation: 100mW; Features: Automotive AEC-Q200; Series: ERJ; Technology: THICK FILM; Resistance Tolerance: 5%; Construction: Rectangular; Length: 1.6mm; Width: 0.8mm; Depth: 0.8mm; Radiation Hardening: No; Military Standard: Not; Lead Free: Contains Lead; RoHS Compliant: Yes; Reach SVHC Compliant: Unknown; ComponentLink1URL: https://datasheet.ciiva.com/11821/0900766b80f806dd-11821482.pdf?src-supplier=Rs; ComponentLink1Description: https://datasheet.ciiva.com/11821/0900766b80f806dd-11821482.pdf?src-supplier=Rs; ComponentLink2URL: https://datasheet.ciiva.com/6138/1500035-6138182.pdf?src-supplier=Farnell; ComponentLink2Description: https://datasheet.ciiva.com/6138/1500035-6138182.pdf?src-supplier=Farnell; ComponentLink3URL: https://datasheet.ciiva.com/6138/1500035-6138185.pdf?src-supplier=Farnell; ComponentLink3Description: https://datasheet.ciiva.com/6138/1500035-6138185.pdf?src-supplier=Farnell; ComponentLink4URL: https://datasheet.ciiva.com/9117/aoa0000ce1-9117352.pdf?src-supplier=Avnet; ComponentLink4Description: https://datasheet.ciiva.com/9117/aoa0000ce1-9117352.pdf?src-supplier=Avnet; ComponentLink5URL: https://datasheet.ciiva.com/30143/4aoa0000ce1-30143370.pdf?src-supplier=Onlinecomponents.com; ComponentLink5Description: https://datasheet.ciiva.com/30143/4aoa0000ce1-30143370.pdf?src-supplier=Onlinecomponents.com; ComponentLink6URL: https://datasheet.ciiva.com/16770/70255313-16770365.pdf?src-supplier=Allied+Electronics; ComponentLink6Description: https://datasheet.ciiva.com/16770/70255313-16770365.pdf?src-supplier=Allied+Electronics; ComponentLink7URL: https://datasheet.ciiva.com/16780/70255313-16780234.pdf?src-supplier=Allied+Electronics; ComponentLink7Description: https://datasheet.ciiva.com/16780/70255313-16780234.pdf?src-supplier=Allied+Electronics; ComponentLink8URL: https://datasheet.ciiva.com/22704/1500035-22704127.pdf?src-supplier=Element14; ComponentLink8Description: https://datasheet.ciiva.com/22704/1500035-22704127.pdf?src-supplier=Element14; ComponentLink9URL: https://datasheet.ciiva.com/28590/1678796-28590780.pdf?src-supplier=Element14; ComponentLink9Description: https://datasheet.ciiva.com/28590/1678796-28590780.pdf?src-supplier=Element14; ComponentLink10URL: https://datasheet.ciiva.com/28673/1678796-28673997.pdf?src-supplier=Element14; ComponentLink10Description: https://datasheet.ciiva.com/28673/1678796-28673997.pdf?src-supplier=Element14; ComponentLink11URL: https://datasheet.ciiva.com/24069/aoa0000ce1-37422-24069415.pdf?src-supplier=Mouser; ComponentLink11Description: https://datasheet.ciiva.com/24069/aoa0000ce1-37422-24069415.pdf?src-supplier=Mouser
R10 = ERJ-3GEYJ104V: 100K Ohm 5%  Res Thick Film 0603 1/10W +/-200ppm/ßC Molded SMD Punched Carrier T/R; Manufacturer_Name: Panasonic; Value: 100kR; Power Rating: 100mW; Voltage Rating: 75V; Temperature Coefficient: 200ppm/°C; Voltage Rating (DC): 50V; Datasheet Link: http://docs-europe.electrocomponents.com/webdocs/13ba/0900766b813ba21b.pdf; Height: 0.55mm; Manufacturer_Part_Number: ERJ-3GEYJ104V; Mouser Part Number: 667-ERJ-3GEYJ104V; Mouser Price/Stock: https://www.mouser.co.uk/ProductDetail/Panasonic/ERJ-3GEYJ104V?qs=66DK8nO8gJC7IhSuep78kw%3D%3D; Arrow Part Number: ERJ-3GEYJ104V; Arrow Price/Stock: https://www.arrow.com/en/products/erj-3geyj104v/panasonic?region=nac; Supplier: Digikey; Supplier Part Number: P100KGCT-ND; Manufacturer: Panasonic; Manufacturer Part Number: ERJ-3GEYJ104V; RoHS: Yes; Category: Chip SMD Resistors; Stock: 248896; Pricing: 1=0.1, 10=0.033, 50=0.02, 100=0.0165, 500=0.01096, 1000=0.00939 (USD); Mounting Technology: Surface Mount; Case/Package: 0603; Case Code (Imperial): 0603; Case Code (Metric): 1608; Weight: 7.1E-05oz; Contact Plating: Tin; Min Operating Temperature: -55°C; Max Operating Temperature: 155°C; Tolerance: 5%; Packaging: Tape and Reel; Package Quantity: 1; Resistor Type: Thick Film; Termination: SMD/SMT; Number of Terminations: 2; Max Power Dissipation: 100mW; Features: Automotive AEC-Q200; Series: ERJ; Construction: Rectangular; Resistance Tolerance: 5%; Technology: THICK FILM; Length: 1.6mm; Width: 0.8mm; Depth: 0.8mm; Reach SVHC Compliant: No; Military Standard: Not; RoHS Compliant: Yes; ComponentLink1URL: https://datasheet.ciiva.com/11809/0900766b80f806dd-11809567.pdf?src-supplier=Rs; ComponentLink1Description: https://datasheet.ciiva.com/11809/0900766b80f806dd-11809567.pdf?src-supplier=Rs; ComponentLink2URL: https://datasheet.ciiva.com/22758/1678796-22758220.pdf?src-supplier=Farnell; ComponentLink2Description: https://datasheet.ciiva.com/22758/1678796-22758220.pdf?src-supplier=Farnell; ComponentLink3URL: https://datasheet.ciiva.com/43460/1678796-43460761.pdf?src-supplier=Farnell; ComponentLink3Description: https://datasheet.ciiva.com/43460/1678796-43460761.pdf?src-supplier=Farnell; ComponentLink4URL: https://datasheet.ciiva.com/24159/aoa0000ce1-37422-24159717.pdf?src-supplier=Mouser; ComponentLink4Description: https://datasheet.ciiva.com/24159/aoa0000ce1-37422-24159717.pdf?src-supplier=Mouser; ComponentLink5URL: https://datasheet.ciiva.com/46380/1678796-46380412.pdf?src-supplier=Element14; ComponentLink5Description: https://datasheet.ciiva.com/46380/1678796-46380412.pdf?src-supplier=Element14; ComponentLink6URL: https://datasheet.ciiva.com/46389/1678796-46389629.pdf?src-supplier=Element14; ComponentLink6Description: https://datasheet.ciiva.com/46389/1678796-46389629.pdf?src-supplier=Element14; ComponentLink7URL: https://datasheet.ciiva.com/27055/1988495-27055706.pdf?src-supplier=Jameco; ComponentLink7Description: https://datasheet.ciiva.com/27055/1988495-27055706.pdf?src-supplier=Jameco; ComponentLink8URL: https://datasheet.ciiva.com/16762/70255313-16762591.pdf?src-supplier=Allied+Electronics; ComponentLink8Description: https://datasheet.ciiva.com/16762/70255313-16762591.pdf?src-supplier=Allied+Electronics; ComponentLink9URL: https://datasheet.ciiva.com/16508/aoa0000ce1-16508383.pdf?src-supplier=Future+Electronics; ComponentLink9Description: https://datasheet.ciiva.com/16508/aoa0000ce1-16508383.pdf?src-supplier=Future+Electronics
R11 R12 = ERJ-3GEYJ222V: 2.2 kOhm, ï¿½ 5%, 100 mW, 0603 [1608 Metric], Thick Film, General Purpose; Manufacturer_Name: Panasonic; Value: 2.2kR; Power Rating: 100mW; Voltage Rating: 75V; Temperature Coefficient: 200ppm/°C; Voltage Rating (DC): 50V; Datasheet Link: http://docs-europe.electrocomponents.com/webdocs/13ba/0900766b813ba21b.pdf; Height: 0.55mm; Manufacturer_Part_Number: ERJ-3GEYJ222V; Mouser Part Number: 667-ERJ-3GEYJ222V; Mouser Price/Stock: https://www.mouser.co.uk/ProductDetail/Panasonic/ERJ-3GEYJ222V?qs=4WZYzuGhm5pzxkuuO4fqIg%3D%3D; Arrow Part Number: ERJ-3GEYJ222V; Arrow Price/Stock: https://www.arrow.com/en/products/erj-3geyj222v/panasonic?region=nac; Supplier: Digikey; Supplier Part Number: P2.2KGCT-ND; Manufacturer: Panasonic; Manufacturer Part Number: ERJ-3GEYJ222V; RoHS: Yes; Category: Chip SMD Resistors; Stock: 308618; Pricing: 1=0.1, 10=0.033, 50=0.02, 100=0.0165, 500=0.01096, 1000=0.00939 (USD); Mounting Technology: Surface Mount; Case/Package: 0603; Case Code (Imperial): 0603; Case Code (Metric): 1608; Contact Plating: Tin; Min Operating Temperature: -55°C; Max Operating Temperature: 155°C; Package Quantity: 1; Packaging: Tape and Reel; Tolerance: 5%; Resistor Type: Thick Film; Number of Terminations: 2; Termination: SMD/SMT; Max Power Dissipation: 100mW; Working Voltage: 75V; Features: Automotive AEC-Q200; Series: ERJ; Resistance Tolerance: 5%; Construction: Rectangular; Technology: THICK FILM; Length: 1.6mm; Width: 0.8mm; Depth: 0.8mm; Radiation Hardening: No; Reach SVHC Compliant: No; Military Standard: Not; Lead Free: Lead Free; RoHS Compliant: Yes; ComponentLink1URL: https://datasheet.ciiva.com/11821/0900766b80f806dd-11821453.pdf?src-supplier=Rs; ComponentLink1Description: https://datasheet.ciiva.com/11821/0900766b80f806dd-11821453.pdf?src-supplier=Rs; ComponentLink2URL: https://datasheet.ciiva.com/34303/1988639-34303614.pdf?src-supplier=Jameco; ComponentLink2Description: https://datasheet.ciiva.com/34303/1988639-34303614.pdf?src-supplier=Jameco; ComponentLink3URL: https://datasheet.ciiva.com/22758/1500035-22758223.pdf?src-supplier=Farnell; ComponentLink3Description: https://datasheet.ciiva.com/22758/1500035-22758223.pdf?src-supplier=Farnell; ComponentLink4URL: https://datasheet.ciiva.com/9117/aoa0000ce1-9117127.pdf?src-supplier=Avnet; ComponentLink4Description: https://datasheet.ciiva.com/9117/aoa0000ce1-9117127.pdf?src-supplier=Avnet; ComponentLink5URL: https://datasheet.ciiva.com/28584/1678796-28584095.pdf?src-supplier=Element14; ComponentLink5Description: https://datasheet.ciiva.com/28584/1678796-28584095.pdf?src-supplier=Element14; ComponentLink6URL: https://datasheet.ciiva.com/46380/1500035-46380411.pdf?src-supplier=Element14; ComponentLink6Description: https://datasheet.ciiva.com/46380/1500035-46380411.pdf?src-supplier=Element14; ComponentLink7URL: https://datasheet.ciiva.com/16760/70255313-16760341.pdf?src-supplier=Allied+Electronics; ComponentLink7Description: https://datasheet.ciiva.com/16760/70255313-16760341.pdf?src-supplier=Allied+Electronics; ComponentLink8URL: https://datasheet.ciiva.com/16765/70255313-16765244.pdf?src-supplier=Allied+Electronics; ComponentLink8Description: https://datasheet.ciiva.com/16765/70255313-16765244.pdf?src-supplier=Allied+Electronics; ComponentLink9URL: https://datasheet.ciiva.com/16199/aoa0000ce1-16199902.pdf?src-supplier=Future+Electronics; ComponentLink9Description: https://datasheet.ciiva.com/16199/aoa0000ce1-16199902.pdf?src-supplier=Future+Electronics
R13 = ERJ-3GEYJ103V: 10K Ohm 5% Res Thick Film 0603  0.1W(1/10W) ±200ppm/C Pad SMD Automotive T/R; Manufacturer_Name: Panasonic; Value: 10kR; Temperature Coefficient: 200ppm/°C; Power Rating: 100mW; Voltage Rating: 75V; Datasheet Link: http://docs-europe.electrocomponents.com/webdocs/13ba/0900766b813ba21b.pdf; Height: 0.55mm; Manufacturer_Part_Number: ERJ-3GEYJ103V; Mouser Part Number: 667-ERJ-3GEYJ103V; Mouser Price/Stock: https://www.mouser.co.uk/ProductDetail/Panasonic/ERJ-3GEYJ103V?qs=66DK8nO8gJBWgc%252B0VNNxzg%3D%3D; Arrow Part Number: ERJ-3GEYJ103V; Arrow Price/Stock: https://www.arrow.com/en/products/erj-3geyj103v/panasonic?region=europe; Supplier: Digikey; Supplier Part Number: P10KGCT-ND; Manufacturer: Panasonic; Manufacturer Part Number: ERJ-3GEYJ103V; RoHS: Yes; Category: Chip SMD Resistors; Stock: 2191587; Pricing: 1=0.1, 10=0.033, 50=0.02, 100=0.0165, 500=0.01096, 1000=0.00939 (USD); Mounting Technology: Surface Mount; Case/Package: 0603; Case Code (Imperial): 0603; Case Code (Metric): 1608; Weight: 7.1E-05oz; Contact Plating: Tin; Min Operating Temperature: -55°C; Max Operating Temperature: 155°C; Tolerance: 5%; Packaging: Tape and Reel; Technology: THICK FILM; Package Quantity: 1; Resistor Type: Thick Film; Termination: SMD/SMT; Number of Terminations: 2; Max Power Dissipation: 100mW; Working Voltage: 75V; Features: Automotive AEC-Q200; Series: ERJ; Construction: Rectangular; Resistance Tolerance: 5%; Length: 1.6mm; Width: 0.8mm; Depth: 0.8mm; Reach SVHC Compliant: No; Military Standard: Not; Lead Free: Lead Free; RoHS Compliant: Yes; ComponentLink1URL: https://datasheet.ciiva.com/11809/0900766b80f806dd-11809566.pdf?src-supplier=Rs; ComponentLink1Description: https://datasheet.ciiva.com/11809/0900766b80f806dd-11809566.pdf?src-supplier=Rs; ComponentLink2URL: https://datasheet.ciiva.com/34303/2007265-34303757.pdf?src-supplier=Jameco; ComponentLink2Description: https://datasheet.ciiva.com/34303/2007265-34303757.pdf?src-supplier=Jameco; ComponentLink3URL: https://datasheet.ciiva.com/48531/aoa0000ce1-48531887.pdf?src-supplier=Avnet; ComponentLink3Description: https://datasheet.ciiva.com/48531/aoa0000ce1-48531887.pdf?src-supplier=Avnet; ComponentLink4URL: https://datasheet.ciiva.com/9117/aoa0000ce1-9117038.pdf?src-supplier=Avnet; ComponentLink4Description: https://datasheet.ciiva.com/9117/aoa0000ce1-9117038.pdf?src-supplier=Avnet; ComponentLink5URL: https://datasheet.ciiva.com/28514/1678796-28514213.pdf?src-supplier=Element14; ComponentLink5Description: https://datasheet.ciiva.com/28514/1678796-28514213.pdf?src-supplier=Element14; ComponentLink6URL: https://datasheet.ciiva.com/46371/1678796-46371909.pdf?src-supplier=Element14; ComponentLink6Description: https://datasheet.ciiva.com/46371/1678796-46371909.pdf?src-supplier=Element14; ComponentLink7URL: https://datasheet.ciiva.com/46385/1678796-46385240.pdf?src-supplier=Element14; ComponentLink7Description: https://datasheet.ciiva.com/46385/1678796-46385240.pdf?src-supplier=Element14; ComponentLink8URL: https://datasheet.ciiva.com/24133/aoa0000ce1-37422-24133064.pdf?src-supplier=Mouser; ComponentLink8Description: https://datasheet.ciiva.com/24133/aoa0000ce1-37422-24133064.pdf?src-supplier=Mouser; ComponentLink9URL: https://datasheet.ciiva.com/16740/aoa0000ce1-16740655.pdf?src-supplier=Future+Electronics; ComponentLink9Description: https://datasheet.ciiva.com/16740/aoa0000ce1-16740655.pdf?src-supplier=Future+Electronics; ComponentLink10URL: https://datasheet.ciiva.com/30147/4aoa0000ce1-30147029.pdf?src-supplier=Onlinecomponents.com; ComponentLink10Description: https://datasheet.ciiva.com/30147/4aoa0000ce1-30147029.pdf?src-supplier=Onlinecomponents.com
U7 = TVS2200DRVR: ESD Suppressors / TVS Diodes 22V flat-clamp surge protection device 6-WSON -40 to 125; MF: Texas Instruments; Number of Channels: 1; Clamping Voltage: 28V; Direction: Unidirectional; Breakdown Voltage: 24.6V; Peak Pulse Current: 40A; SnapEDA_Link: https://www.snapeda.com/parts/TVS2200DRVR/Texas+Instruments/view-part/?ref=snap; Package: WSON-6 Texas Instruments; Value: *; MP: TVS2200DRVR; Check_prices: https://www.snapeda.com/parts/TVS2200DRVR/Texas+Instruments/view-part/?ref=eda; Supplier: Digikey; Supplier Part Number: 296-52187-1-ND; Manufacturer: Texas Instruments; Manufacturer Part Number: TVS2200DRVR; RoHS: Yes; Category: ESD and Circuit Protection ICs; Stock: 5934; Pricing: 1=0.54, 10=0.373, 100=0.254, 500=0.199, 1000=0.181 (USD); Mounting Technology: Surface Mount; Pins: 6; Min Operating Temperature: -40°C; Max Operating Temperature: 125°C; Packaging: Cut Tape; Number of Circuits: 1; Series: -; Reverse Standoff Voltage: 22V; Length: 2mm; Width: 2mm; Height: 800um; Thickness: 750um; RoHS Compliant: Yes; ComponentLink1URL: http://www.ti.com/general/docs/suppproductinfo.tsp?distId=10&amp;gotoUrl=http%3A%2F%2Fwww.ti.com%2Flit%2Fgpn%2Ftvs2200&src-supplier=Digikey; ComponentLink1Description: http://www.ti.com/general/docs/suppproductinfo.tsp?distId=10&amp;gotoUrl=http%3A%2F%2Fwww.ti.com%2Flit%2Fgpn%2Ftvs2200&src-supplier=Digikey; ComponentLink2URL: http://www.ti.com/lit/ds/symlink/tvs2200.pdf?src-supplier=Digikey; ComponentLink2Description: http://www.ti.com/lit/ds/symlink/tvs2200.pdf?src-supplier=Digikey
U8 = SY6280AAC: 2.4V~5.5V 80mΩ Active High 1 High-side switch SOT-23-5 Power Distribution Switches ROHS; Manufacturer_Name: Silergy; Datasheet Link: https://datasheet.lcsc.com/szlcsc/Silergy-Corp-SY6280AAC_C55136.pdf; Height: 1.4mm; Manufacturer_Part_Number: SY6280AAC
U9 = FUSB302BMPX: USB Controller USB 3.1 USB Interface 14-MLP (2.5x2.5); Manufacturer_Name: onsemi; Datasheet Link: https://www.onsemi.com/pub/Collateral/FUSB302B-D.PDF; Height: 0.8mm; Manufacturer_Part_Number: FUSB302BMPX; Mouser Part Number: 512-FUSB302BMPX; Mouser Price/Stock: https://www.mouser.co.uk/ProductDetail/onsemi-Fairchild/FUSB302BMPX?qs=8ziscO3x5y1SHqdwooDK6g%3D%3D; Arrow Part Number: FUSB302BMPX; Arrow Price/Stock: https://www.arrow.com/en/products/fusb302bmpx/on-semiconductor?utm_currency=USD&region=nac
U10-U12 = TPD4E02B04DQAR: TVS DIODE 3.6V 8.8V 10USON / 4-Channel ESD Protection Diode for USB Type-C and HDMI 2.0; Mfr_Name: Texas Instruments; CompType: IC; Number of Bidirectional Channels: 4; Min Breakdown Voltage: 5.5V; Peak Pulse Power: 17W; Power Line Protection: No; Peak Pulse Current: 5A; Interface: USB,HDMI; Diode Type: ZENER; Direction: 211Direction; Breakdown Voltage: 6.4V; TYPE: TYPE; RefDes: RefDes; Application_BuildNumber: *; PartNumber: TPD4E02B04DQAR; PackageReference: DQA0010A; MountType: SMT; RoHS: Y; Manufacturer: Texas Instruments; Supplier: Digikey; Supplier Part Number: 296-43875-1-ND; Manufacturer Part Number: TPD4E02B04DQAR; Category: Integrated Circuits (ICs); Mounting Technology: Surface Mount; Pins: 10; Min Operating Temperature: -40°C; Max Operating Temperature: 125°C; Packaging: Cut Tape; Reverse Standoff Voltage: 3.6V; Operating Supply Voltage: 3.6V; Number of Channels: 4; Series: -; Length: 2.5mm; Width: 1mm; Height: 550um; Thickness: 500um; Reach SVHC Compliant: No; Lead Free: Lead Free; RoHS Compliant: Yes; ComponentLink1URL: http://www.ti.com/lit/ds/symlink/tpd4e02b04.pdf?src-supplier=Digikey; ComponentLink1Description: http://www.ti.com/lit/ds/symlink/tpd4e02b04.pdf?src-supplier=Digikey; ComponentLink2URL: http://www.ti.com/lit/ds/symlink/tpd4e02b04.pdf?src-supplier=Farnell; ComponentLink2Description: http://www.ti.com/lit/ds/symlink/tpd4e02b04.pdf?src-supplier=Farnell; ComponentLink3URL: http://www.ti.com/lit/ds/symlink/tpd4e02b04.pdf?src-supplier=Newark; ComponentLink3Description: http://www.ti.com/lit/ds/symlink/tpd4e02b04.pdf?src-supplier=Newark; ComponentLink4URL: http://www.ti.com/general/docs/lit/getliterature.tsp?genericPartNumber=TPD4E02B04&amp;&amp;fileType=pdf&src-supplier=Element14; ComponentLink4Description: http://www.ti.com/general/docs/lit/getliterature.tsp?genericPartNumber=TPD4E02B04&amp;&amp;fileType=pdf&src-supplier=Element14